# Altium schematic sheet PowerSupply.SchDoc: TITLE
size A4; DrawnBy: D Kleiss; Organization: Flinders University; Address1: College of Science & Engineering; Address2: Engineering Services Room 3.22; Address3: 1284 South Rd; Address4: SA 5042; DocumentNumber: A4; Revision: 1; SheetNumber: 1; SheetTotal: 1
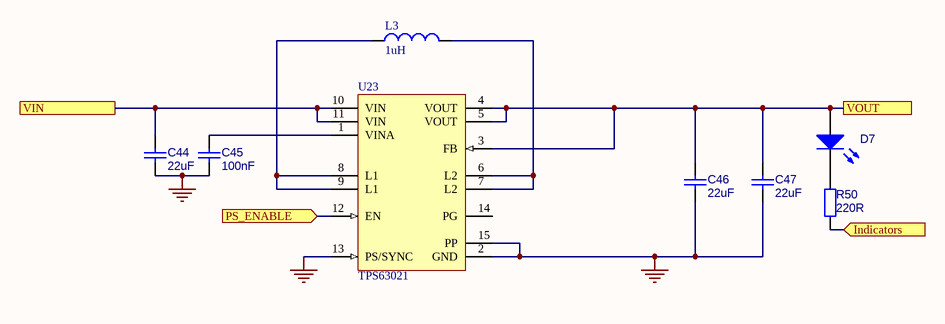
[diagram p0: PowerSupply.SchDoc]

## Parts
C44  22uF  [0603_CAP UF HD]
C45  100nF  [0603_CAP UF HD]
C46  22uF  [0603_CAP UF HD]
C47  22uF  [0603_CAP UF HD]
D7  (no value)  [LED 3mm Red]
L3  value 1uH  [252012]  (hidden comment: Inductor)
R50  220R  [0603-RESISTOR HD]
U23  TPS63021  [DSJ14-4000X1580TP_V]

## Ports
Indicators (in), PS_ENABLE (in), VIN, VOUT

## Nets
GND: C44.2 C45.2 C46.2 C47.2 U23.2(GND) U23.13(PS/SYNC) U23.15(PP)
Indicators: R50.2 ; port Indicators
PS_ENABLE: U23.12(EN) ; port PS_ENABLE
VIN: C44.1 U23.10(VIN) U23.11(VIN) ; port VIN
VOUT: C46.1 C47.1 D7.A U23.3(FB) U23.4(VOUT) U23.5(VOUT) ; port VOUT
NetC45_1: C45.1 U23.1(VINA)
NetD7_K: D7.K R50.1
NetL3_1: L3.1 U23.8(L1) U23.9(L1)
NetL3_2: L3.2 U23.6(L2) U23.7(L2)

Not connected (* = marked no-connect by the designer): U23 14(PG)

## Notes on the sheet
- Title
- Size:
- Date:
- A4
- Number:
- Revision:
- Sheet
- Drawn By:
- of
- File:

## Library data of the parts
C44 C46 C47 = Cap: Capacitor; Manufacturer: MuRata; Manufacturer Number: GRM188R60J226MEA0D; Value: 22uF; Digikey Number: 490-7611-1-ND
C45 = Cap: Capacitor; Value: 100nF
D7 = LED: Manufacturer: *; Element 14 Part Number: *; Digikey Number: 732-5005-ND
L3 = Inductor: Manufacturer: Samsung Electro-Mechanics; Manufacturer Number: CIGW252010GL1R0MNE; Digikey Number: 1276-6932-1-ND
R50 = Resistor: Value: 220R
U23 = TPS63020DSJ14: High Efficiency Single Inductor Buck-Boost Converter, 4 A, 1.8 to 5.5 V Input, 1.2 to 5.5 V Output, -40 to 85 degC, 14-Pin VSON (DSJ), Green (RoHS & no Sb/Br), Tape and Reel; Manufacturer: Texas Instruments; Manufacturer Number: TPS63021; Digikey Number: 296-37448-1-ND‎